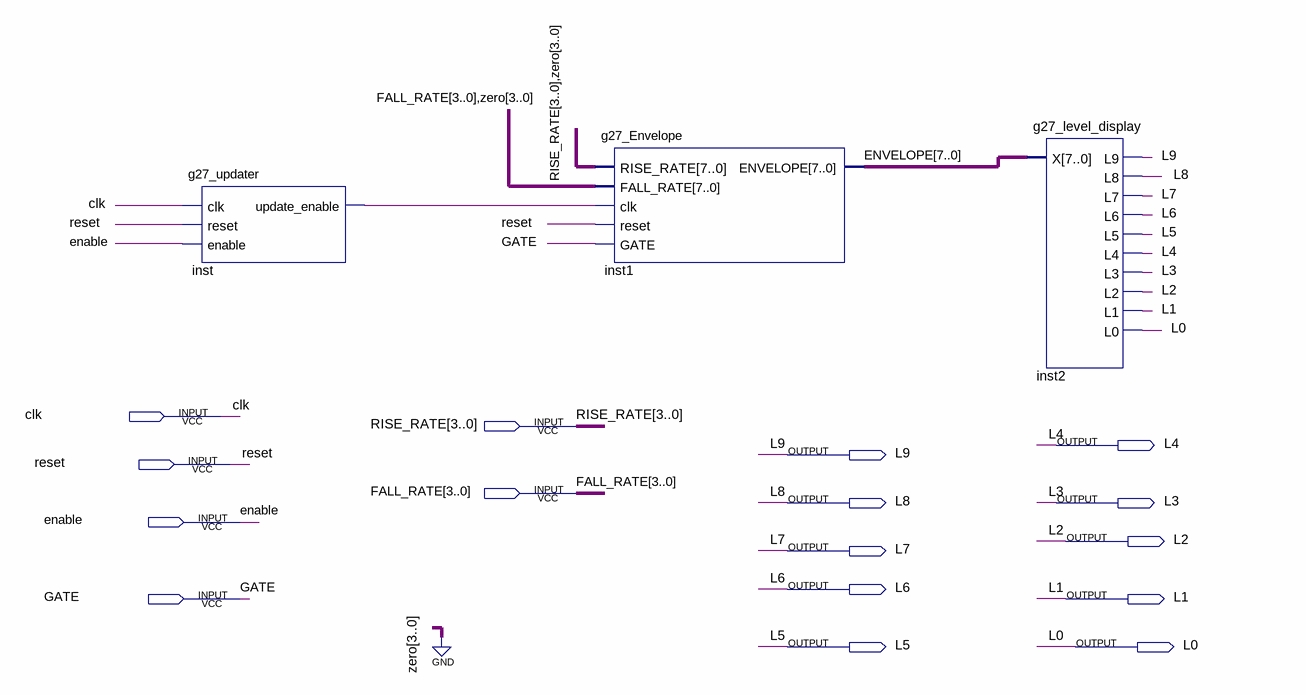
[diagram p0: schematic sheet]
// Quartus schematic g27_envelope_testbed.bdf as structural Verilog: 3 symbols, 16 pins
module g27_envelope_testbed (
  input  clk,
  input  [3:0] RISE_RATE,
  input  reset,
  input  [3:0] FALL_RATE,
  input  enable,
  input  GATE,
  output L4,
  output L9,
  output L8,
  output L3,
  output L2,
  output L7,
  output L6,
  output L1,
  output L5,
  output L0
);

  wire inst_update_enable;
  wire [7:0] ENVELOPE;

  g27_updater inst (.clk(clk), .reset(reset), .enable(enable), .update_enable(inst_update_enable));
  g27_Envelope inst1 (
    .RISE_RATE({RISE_RATE, 4'b0000}), .FALL_RATE({FALL_RATE, 4'b0000}), .clk(inst_update_enable),
    .reset(reset), .GATE(GATE), .ENVELOPE(ENVELOPE));
  g27_level_display inst2 (
    .X(ENVELOPE), .L9(L9), .L8(L8), .L7(L7), .L6(L6), .L5(L5), .L4(L4), .L3(L3), .L2(L2), .L1(L1), .L0(L0));
endmodule
